# EAGLE design diff_probe (EAGLE 6.4)
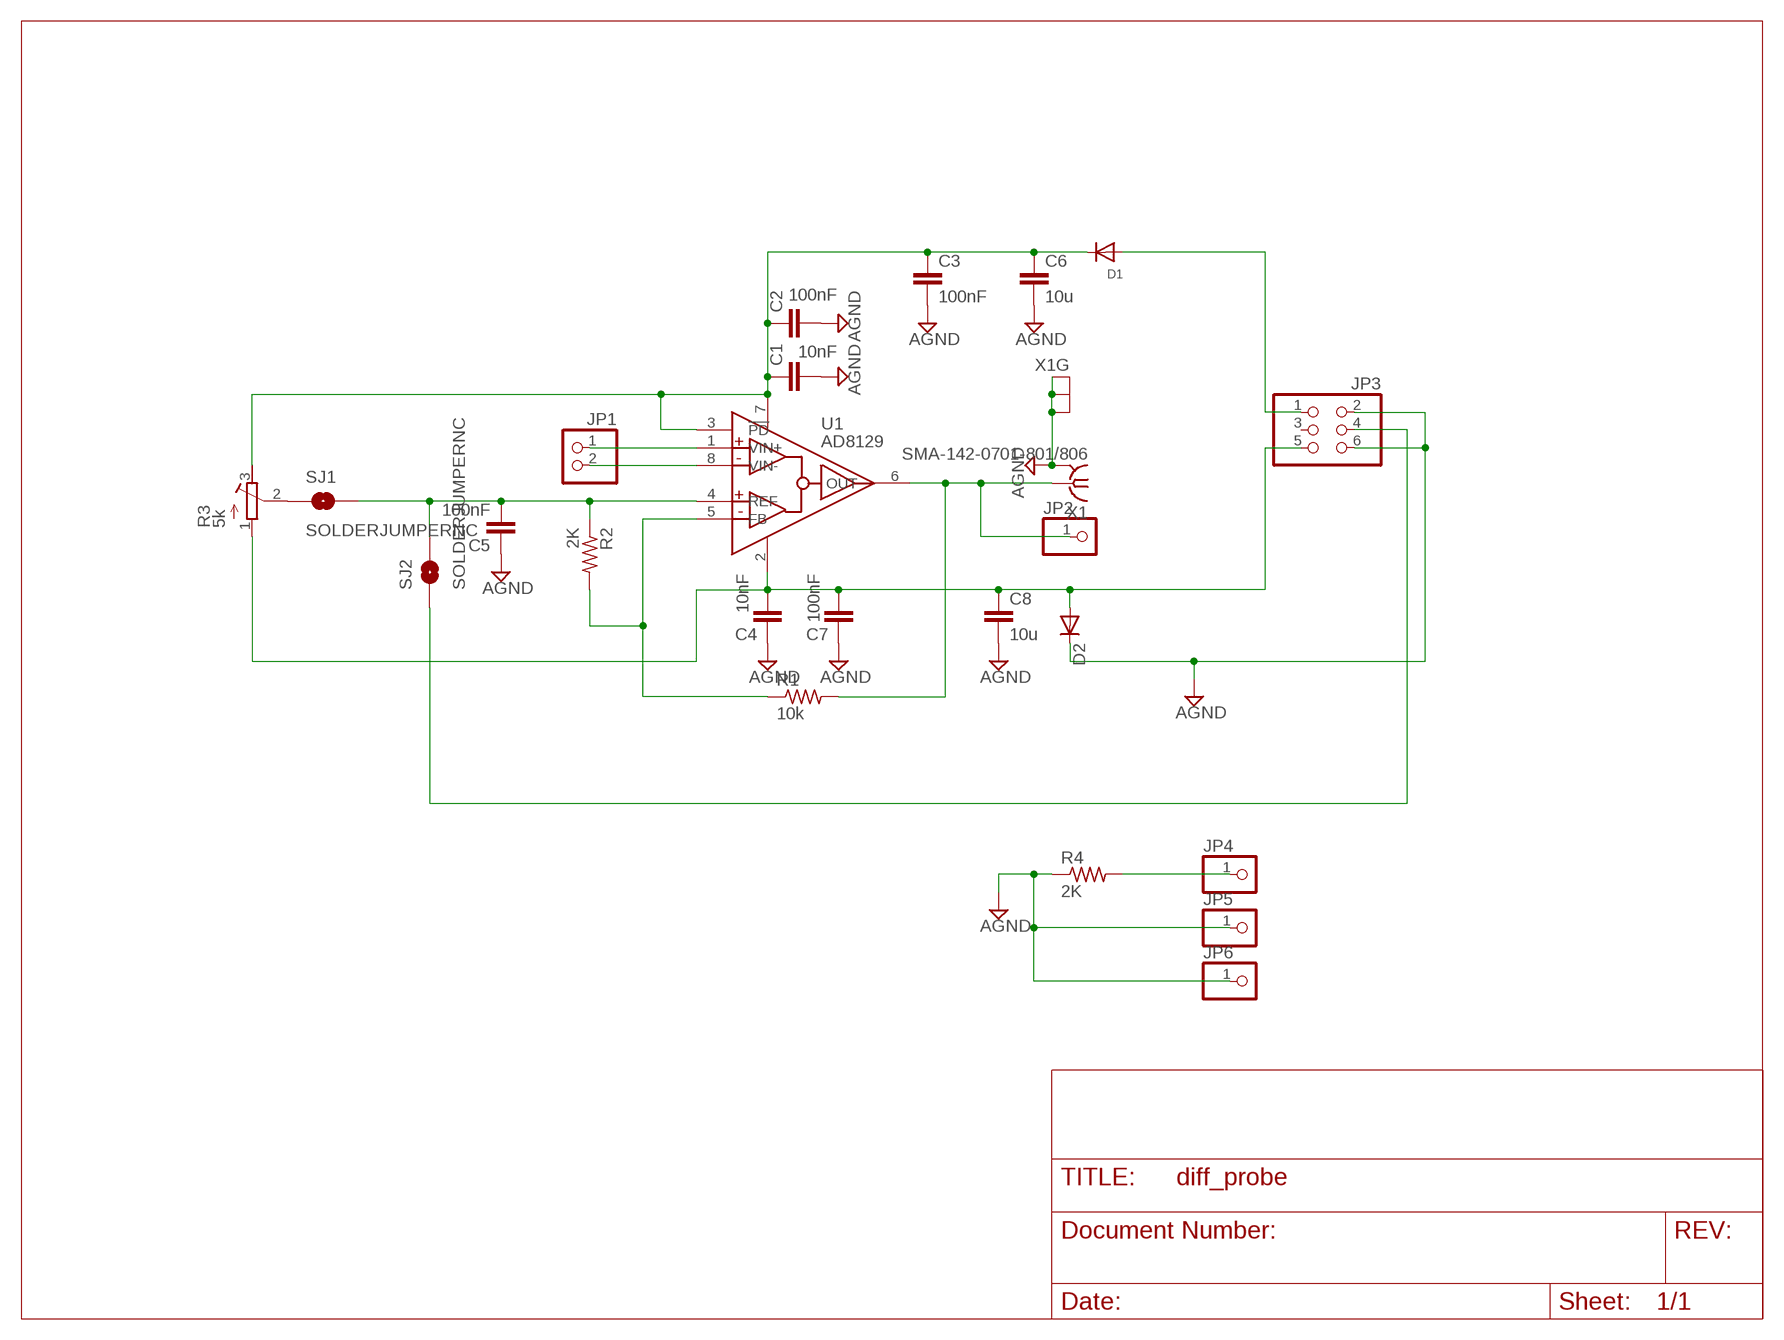
[diagram p0: schematic, sheet 1]

## Parts
C1  10nF  C-EUC0603  [C0603]
C2  100nF  C-EUC0603  [C0603]
C3  100nF  C-EUC0603  [C0603]
C4  10nF  C-EUC0603  [C0603]
C5  100nF  C-EUC0603  [C0603]
C6  10u  C-EUC0805  [C0805]
C7  100nF  C-EUC0603  [C0603]
C8  10u  C-EUC0805  [C0805]
D1  DIODESOD-123  [SOD-123]
D2  DIODE-DO-214AC  [DO-214AC]
JP1  PINHD-1X2/90  [1X02/90]
JP2  PINHD-1X1  [1X01]
JP3  PINHD-2X3EDGE  [6PAD_ISP]
JP4  PINHD-1X1  [1X01]
JP5  PINHD-1X1  [1X01]
JP6  PINHD-1X1  [1X01]
R1  10k  R-US_R0603  [R0603]
R2  2K  R-US_R0603  [R0603]
R3  5k  R-TRIMM3224J  [RTRIM3224J]
R4  2K  R-US_R0603  [R0603]
SJ1  SOLDERJUMPERNC  [SJ_2S]
SJ2  SOLDERJUMPERNC  [SJ_2S]
U1  AD8129  [SO08]
X1  SMA-142-0701-801/806  [J502-ND-142-0701-801/806]

## Nets
AGND: C1.2 C2.2 C3.2 C4.1 C5.1 C6.2 C7.1 C8.2 D2.C JP3.2 JP3.6 JP5.1 JP6.1 R4.1 X1.G@1(GND) X1.G@2(GND) X1.G@3(GND) X1.G@4(GND)
N$1: D1.A JP3.1
N$2: C1.1 C2.1 C3.1 C6.1 D1.C R3.3(A) U1.3(!PD) U1.7(VCC)
N$3: C5.2 R2.1 SJ1.2 SJ2.2 U1.4(REF)
N$4: R1.1 R2.2 U1.5(FB)
N$5: JP2.1 R1.2 U1.6(OUT) X1.1
N$6: JP1.1 U1.1(VIN+)
N$7: JP1.2 U1.8(VIN-)
N$8: C4.2 C7.2 C8.1 D2.A JP3.5 R3.1(E) U1.2(VSS)
N$9: R3.2(S) SJ1.1
N$10: JP3.4 SJ2.1
N$11: JP4.1 R4.2
Unconnected: JP3.3

## Library data of the parts
C1-C8 = rcl:C-EU: CAPACITOR, European symbol
D1 = adafruit:DIODE: Diode SMADIODE - SMA Surface Mount Package 20V 1A Schottky Diode Digikey: 641-1014-6-ND DO-1N4148 - Through Hole Small Current Diode SOD-123 20V 1 A (.5mV Vf) Schottky Diode - Digikey: MBRX120TPMSCT-ND SOD-323 10V 570mA (.38mV Vf, 3ns) Schottky Diode - Digikey: ZLLS410CT-ND SOD-523 30V 30mA Schottky Diode (RB751S-40TE61) - Digikey: RB751S-40TE61CT-ND SOT23-R/W - SOT23 Package (R = Solder Paste/Reflow Ovens, W = Hand-Soldering) BAT54Film 40V 300mA - Digikey: 497-7162-1-ND
D2 = diode:DIODE-: DIODE
JP1 = pinhead:PINHD-1X2: PIN HEADER
JP2 JP4-JP6 = pinhead:PINHD-1X1: PIN HEADER
JP3 = mystuff:PINHD-2X3: PIN HEADER
R1 R2 R4 = resistor:R-US_: RESISTOR, American symbol
R3 = resistor:R-TRIMM: Trimm resistor
SJ1 SJ2 = SparkFun:SOLDERJUMPER: Solder Jumper Standard SMD solder jumper. Used to automate production. Two varients : Normally Open and Normally Closed are the same, but have different paste layers. NC will have a large amount of paste and should jumper during reflow.
U1 = customs:AD8129
X1 = adc_microboard:SMA-: SMA 50 Ohm End Launch Jack Receptacle - Round Contact Johnson Components Source: www.johnsoncomponents.com .. J502-ND.pdf; MF: JOHNSON COMPONENTS; MPN: 142-0701-801; OC_FARNELL: 1608592; OC_NEWARK: 90F2624

## Board
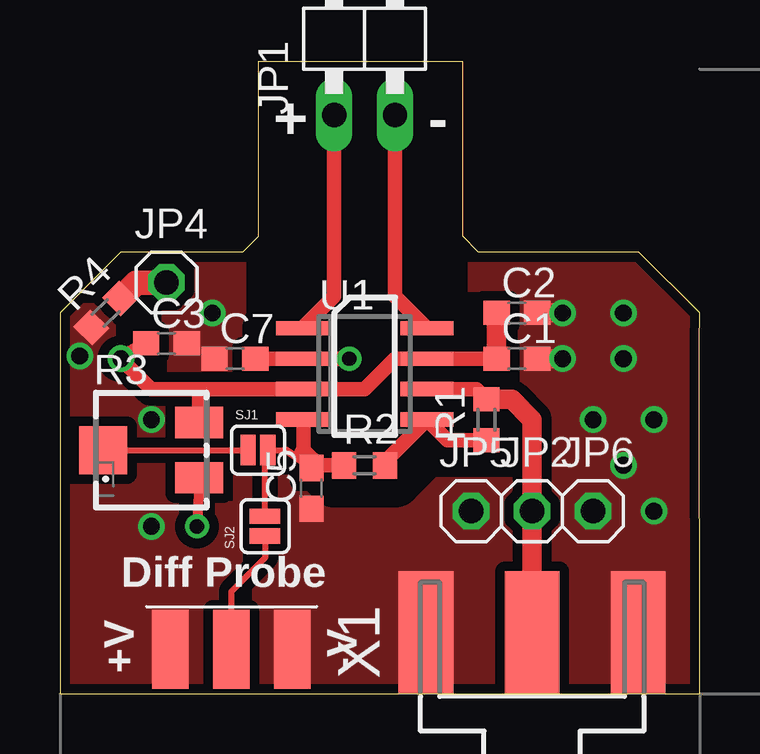
[diagram p1: board, top side]
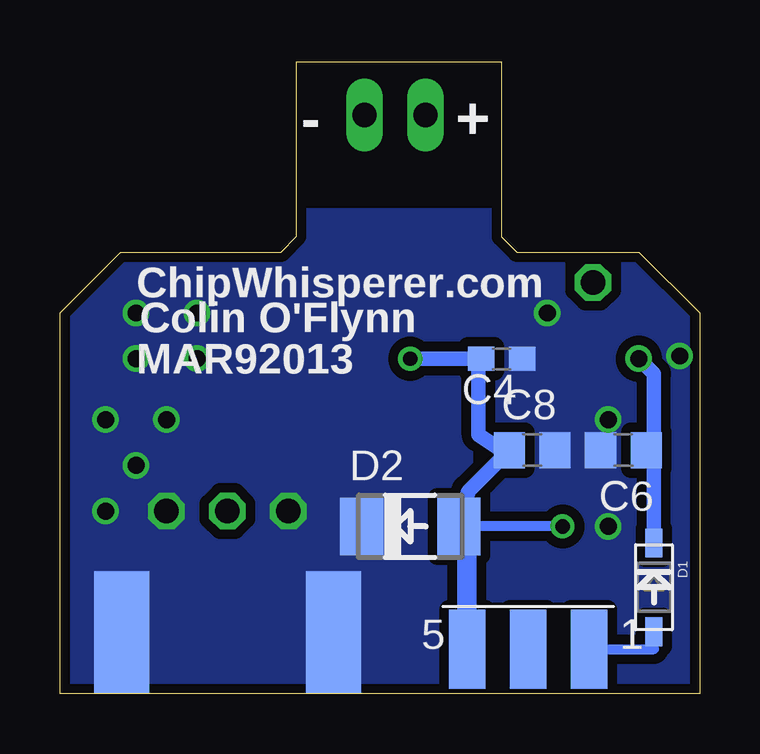
[diagram p2: board, bottom side, seen from below]

Size 26.67 x 26.34 mm. Coordinates in mm from the lower left corner, seen from the top.
Outline: 26.67,0 26.65,14.61 26.67,15.88 24.13,18.41 17.46,18.41 16.8,19.07 16.8,26.34 8.25,26.34 8.25,19.05 7.62,18.41 2.54,18.41 0,15.88 0,0 26.67,0
Copper layers (1*16): Top 0.035mm / dielectric 1.5mm / Bottom 0.035mm
Design rules "default *": minimum track width 10mil, minimum drill 24mil, track to track 8mil, track to pad 8mil, pad to pad 8mil, via to via 8mil, smd to smd 8mil, copper to edge 0.002540625mm, drill to drill 8mil, minimum pad ring 10mil, minimum via ring 8mil, stop-mask expansion 4mil, vias tented up to drill 30mil, thermal gap 10mil
tRestrict: 16 lines
bRestrict: area 8.3,21 to 17.1,26

### Footprints (pad centres in the part's own frame; a part is rotated, then mirrored left to right if it is on the bottom)
C0603 = smd 1.1 x 1: 1 -0.85,0; 2 0.85,0
C0805 = smd 1.3 x 1.5: 1 -0.95,0; 2 0.95,0
SOD-123 = smd 1.2 x 0.7: A 1.85,0; C -1.85,0
DO-214AC = smd 1.8 x 2.4: A 2.025,0; C -2.025,0
1X02/90 = drill 1.016 long: 1 -1.27,-3.81; 2 1.27,-3.81
1X01 = drill 1.016 octagon: 1 0,0
6PAD_ISP = smd 1.524 x 3.302 bottom: 1 -2.54,0; 3 0,0; 5 2.54,0 | smd 1.524 x 3.302: 2 -2.54,0; 4 0,0; 6 2.54,0
R0603 = smd 1 x 1.1: 1 -0.85,0; 2 0.85,0
RTRIM3224J = smd 1.3 x 2: 1 -1.15,-2; 3 1.15,-2 | smd 2 x 2: 2 0,2
SJ_2S = smd 0.635 x 1.27: 1 -0.412,0; 2 0.412,0
SO08 = smd 0.6 x 2.2: 1 -1.905,-2.6; 2 -0.635,-2.6; 3 0.635,-2.6; 4 1.905,-2.6; 5 1.905,2.6; 6 0.635,2.6; 7 -0.635,2.6; 8 -1.905,2.6
J502-ND-142-0701-801/806 = smd 5.08 x 2.286: 1 2.565,0; G@1 2.565,4.42; G@2 2.565,-4.42 | smd 5.08 x 2.286 bottom: G@3 2.565,4.42; G@4 2.565,-4.42

### Placement (x,y rotation side)
C1  19.05,13.97 0 top
C2  19.05,15.88 0 top
C3  4.45,14.61 0 top
C4  8.25,13.97 180 bottom
C5  10.48,8.57 90 top
C6  3.18,10.16 180 bottom
C7  7.3,13.97 0 top
C8  6.98,10.16 0 bottom
D1  1.91,4.45 270 bottom
D2  12.07,6.98 0 bottom
JP1  12.7,27.94 0 top
JP2  19.68,7.62 0 top
JP3  7.15,1.86 0 top
JP4  4.45,17.14 0 top
JP5  17.14,7.62 0 top
JP6  22.23,7.62 0 top
R1  17.78,11.43 90 top
R2  12.7,9.52 0 top
R3  3.81,10.16 90 top
R4  1.91,15.88 45 top
SJ1  8.25,10.16 0 top
SJ2  8.55,7 90 top
U1  12.7,13.34 270 top
X1  19.68,0 90 top

### Tracks (layer width: path | path; a pad name or v marks a point on that pad's centre or on a via)
AGND  (via drill 0.7)
  Top 0.813: C1.2 v20.95,13.97 | C2.2 v20.95,15.88
  other vias: 22.23,11.43 3.81,6.98 6.35,15.88 23.49,15.88 23.49,13.97 24.77,11.43 24.77,7.62 23.49,9.52 3.81,11.43 0.83,14.08
  pour Bottom (isolate 0.406, no thermals): 8.25,26.67 17.14,26.67 17.14,20.32 17.78,19.69 25.4,19.69 29.21,15.88 29.21,-1.91 -1.27,-1.91 -3.81,0.63 -3.81,13.97 2.54,20.32 6.35,20.32 7.62,21.59 7.62,26.03
  pour Top (isolate 0.406, no thermals): 0,15.88 2.54,18.41 7.62,18.41 8.25,19.05 8.25,20.32 16.51,20.32 16.51,19.05 17.14,18.41 24.13,18.41 26.67,15.88 26.67,0 0,0
N$1
  Bottom 0.406: JP3.1 1.91,1.86 D1.A
  Bottom 0.61: 1.96,2.54 D1.A
N$2  (via drill 0.7)
  Top 0.61: C1.1 U1.7 13.97,13.97 12.7,12.7 U1.3 5.71,12.7 | C3.1 v2.54,13.97 3.81,12.7 5.71,12.7 | R3.3 5.81,12.61 5.71,12.7
  Top 0.813: C1.1 C2.1
  Bottom 0.406: C6.1 1.91,10.16
  Bottom 0.61: D1.C 1.91,10.16 1.91,13.34 v2.54,13.97
N$3
  Top 0.254: 9.49,10.11 9.45,10.16 SJ1.2 8.55,10.04 SJ2.2
  Top 0.305: 9.43,10.16 9.49,10.11 C5.2
  Top 0.61: R2.1 10.8,9.52 10.16,10.16 | 10.16,10.16 10.16,11.37 U1.4 | C5.2 10.06,10.06 10.16,10.16
N$4
  Top 0.61: R2.2 13.55,9.68 U1.5 16.15,10.58 R1.1
N$5
  Top 0.61: U1.6 17.36,12.7 R1.2
  Top 0.813: R1.2 18.84,12.28 19.68,11.43 19.68,9.52 JP2.1 X1.1
N$6
  Top 0.61: JP1.1 11.43,16.57 U1.1
N$7
  Top 0.61: JP1.2 13.97,16.57 U1.8
N$8  (via drill 0.6)
  Top 0.406: R3.1 5.81,8.79 v5.71,6.98
  Top 0.61: C7.2 U1.2 v12.07,13.97
  Bottom 0.406: v5.71,6.98 D2.A
  Bottom 0.61: v12.07,13.97 C4.2 9.21,13.75 9.21,10.79 8.25,10.16 C8.1 9.64,8.45 D2.A
  Bottom 0.813: JP3.5 9.69,6 10.16,6.47
  Bottom 1.016: 10.16,6.47 D2.A
N$9
  Top 0.254: R3.2 SJ1.1
N$10
  Top 0.254: JP3.4 7.15,4.28 8.57,5.7 8.57,6.56 SJ2.1
N$11
  Top 1.016: JP4.1 3.18,17.14 R4.2

### Text on the board
tPlace: + | - | Diff Probe | +V | -V
bPlace: + | - | ChipWhisperer.com | Colin O'Flynn | MAR92013